# Altium schematic sheet 08-MagnetSensor.SchDoc: Magnet Sensor
size A2; DocumentNumber: 8; SheetNumber: 8; SheetTotal: 15
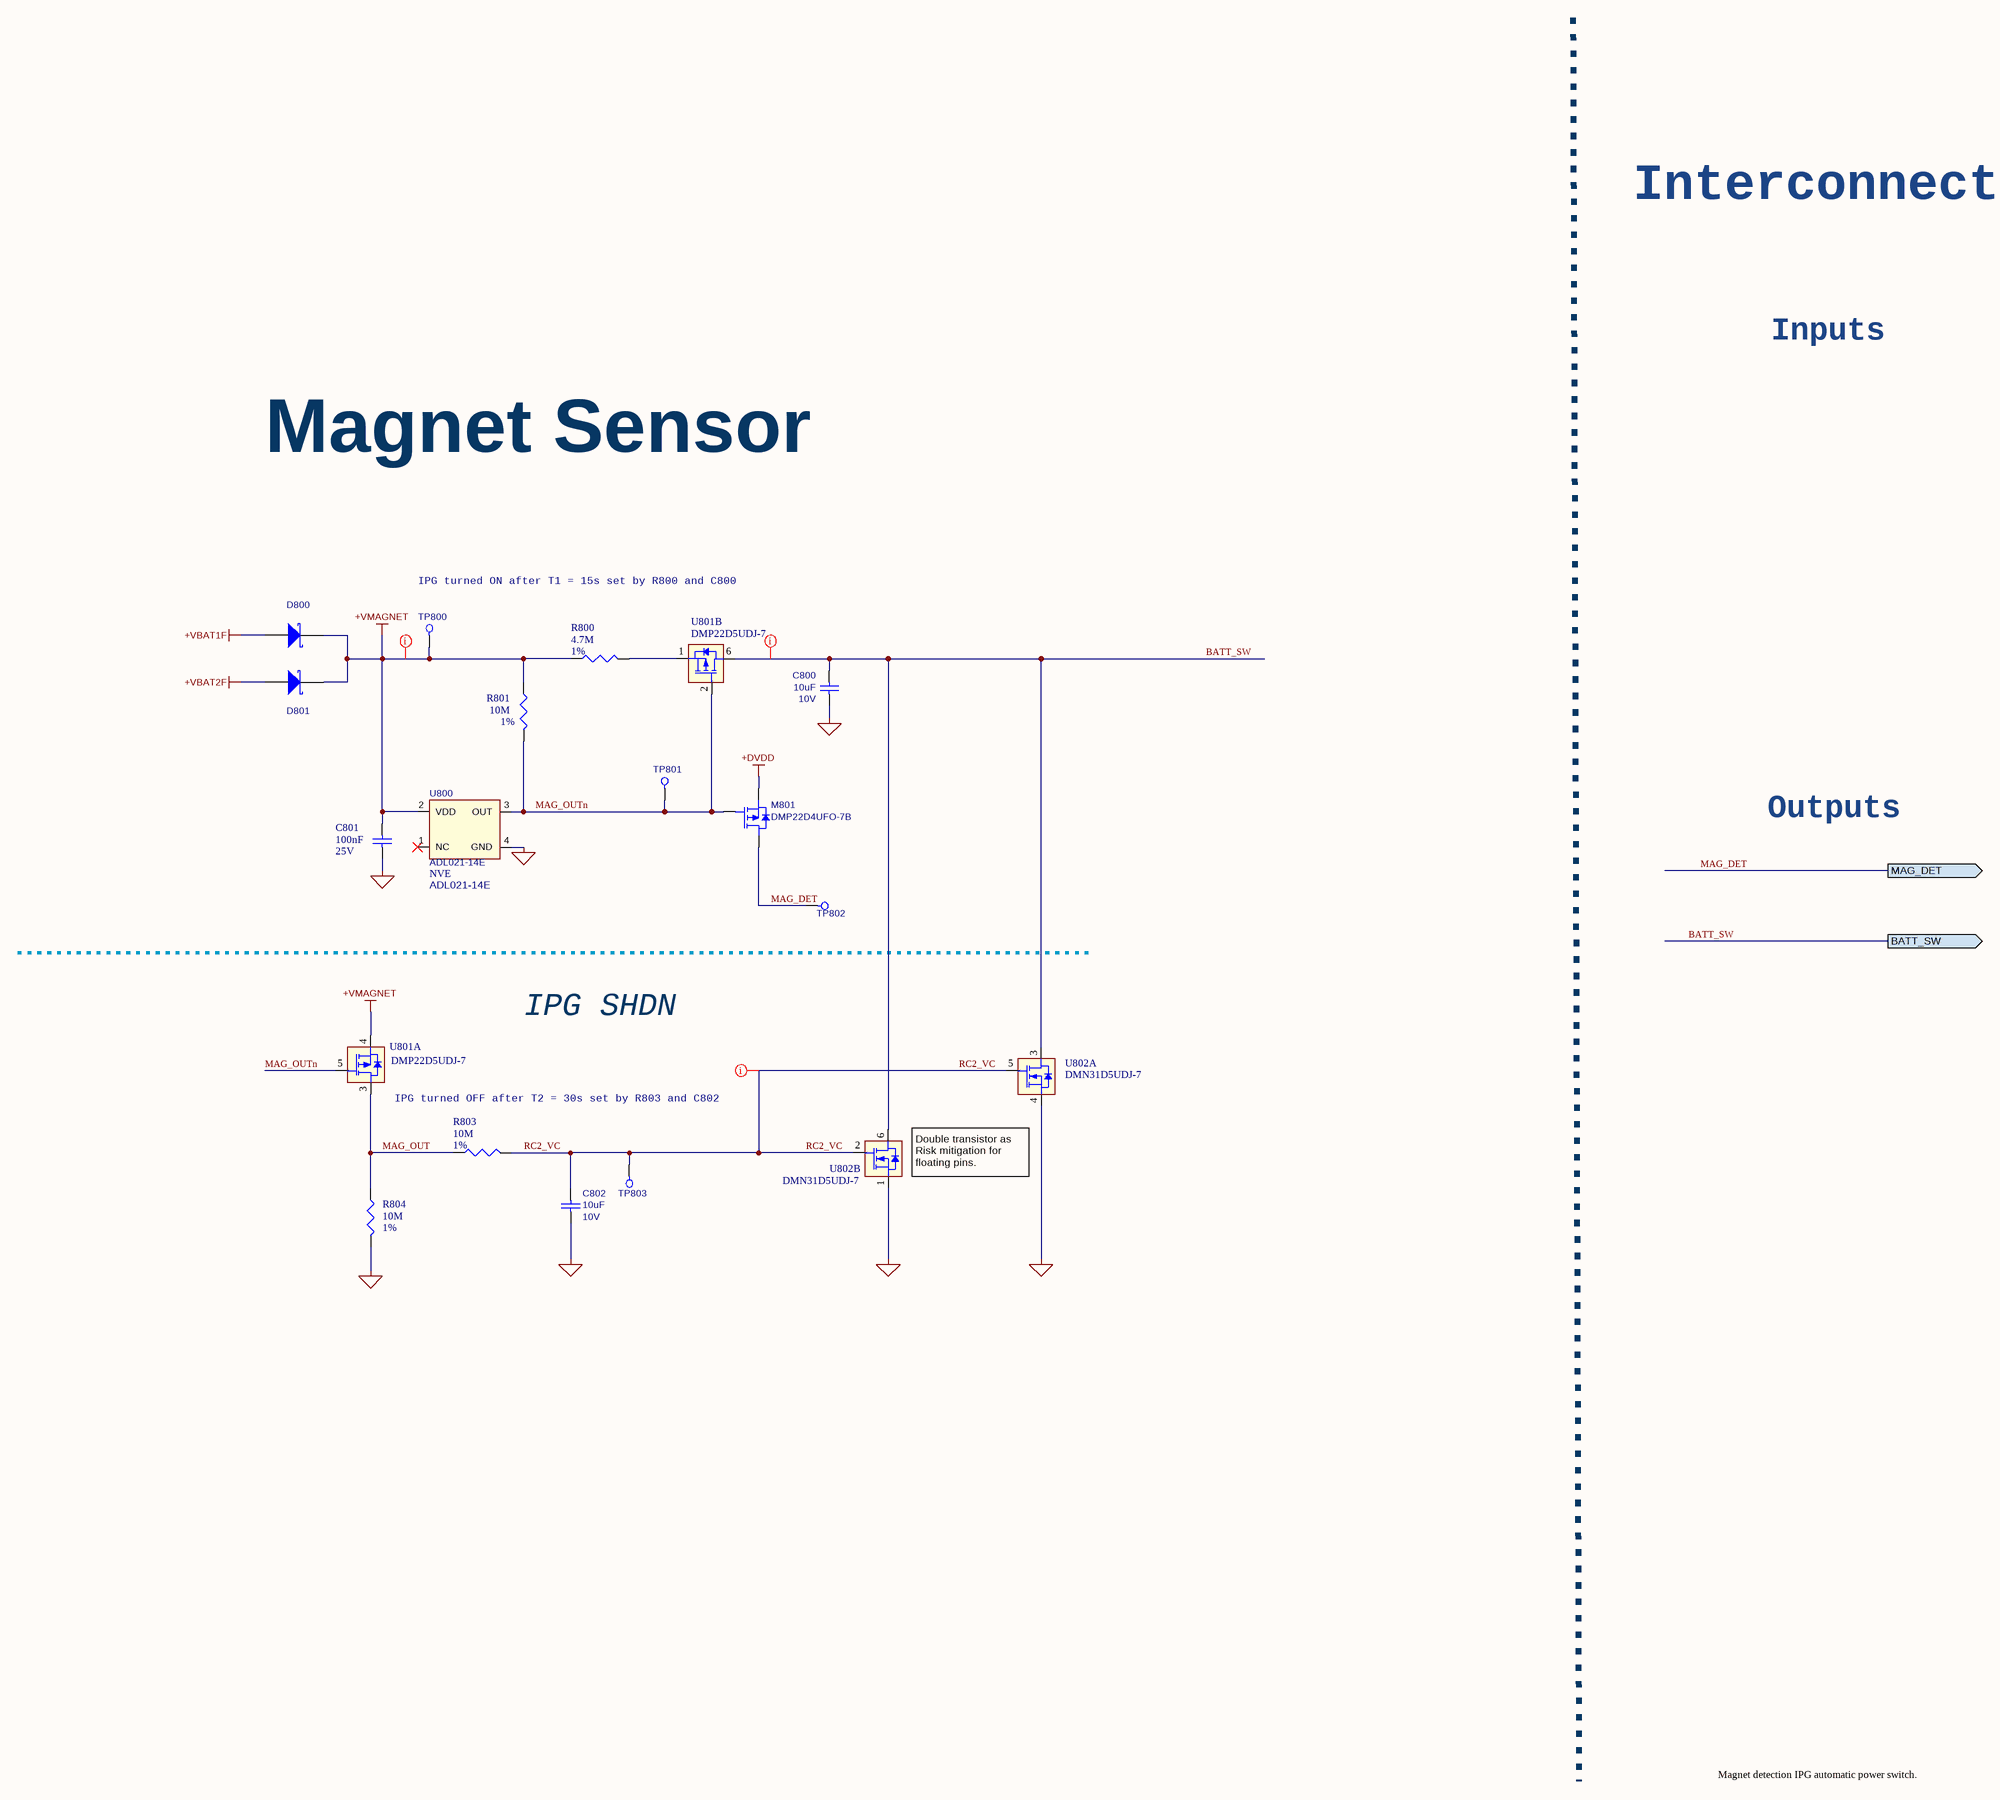
[diagram p0: 08-MagnetSensor.SchDoc]

## Parts
C800  value 10uF  Rating: 10V  [CAP0402_REDUCED]  (hidden comment: ZRB15XR61A106ME01D)
C801  value 100nF  Rated DC Voltage (URdc): 25V  [C0201_C]  (hidden comment: GRM033R61E104KE14J)
C802  value 10uF  Rating: 10V  [CAP0402_REDUCED]  (hidden comment: ZRB15XR61A106ME01D)
D800  NSR0130P2T5G  [ONSC_SOD-923_CASE514AB]  (value not drawn)
D801  NSR0130P2T5G  [ONSC_SOD-923_CASE514AB]  (value not drawn)
M801  DMP22D4UFO-7B  [DIODESINC_X2-DFN0604-3]
R800  value 4.7M  Tolerance: 1%  [R0201_C]  (hidden comment: CRCW02014M70FNED)
R801  value 10M  Tolerance: 1%  [R0201_C]  (hidden comment: CRCW020110M0FNED)
R803  value 10M  Tolerance: 1%  [R0201_C]  (hidden comment: CRCW020110M0FNED)
R804  value 10M  Tolerance: 1%  [R0201_C]  (hidden comment: CRCW020110M0FNED)
TP800  Test Point  [testpad_0.9mm]  (value not drawn)  (no BOM)
TP801  Test Point  [testpad_0.9mm]  (value not drawn)  (no BOM)
TP802  Test Point  [testpad_0.9mm]  (value not drawn)  (no BOM)
TP803  Test Point  [testpad_0.9mm]  (value not drawn)  (no BOM)
U800  ADL021-14E  Manufacturer: NVE  [NVE_ULLGA4]
U801  DMP22D5UDJ-7  [DIODESINC_SOT-963-6]  (parts A,B of 2)
U802  DMN31D5UDJ-7  [DIODESINC_SOT-963-6]  (parts A,B of 2)

## Ports
BATT_SW (out), MAG_DET (out)

## Nets
+DVDD: M801.2(S)
+VBAT1F: D800.2(A)
+VBAT2F: D801.2(A)
+VMAGNET: C801.2 D800.1(K) D801.1(K) R800.1 R801.1 TP800.1 U800.2(VDD) U801.4
GND: C800.2 C801.1 C802.1 R804.2 U800.4(GND) U802.1 U802.4
BATT_SW: C800.1 U801.6 U802.3 U802.6 ; port BATT_SW
MAG_DET: M801.3(D) TP802.1 ; port MAG_DET
MAG_OUT: R803.1 R804.1 U801.3
MAG_OUTn: M801.1(G) R801.2 TP801.1 U800.3(OUT) U801.2 U801.5
RC2_VC: C802.2 R803.2 TP803.1 U802.2 U802.5
NetR800_2: R800.2 U801.1

Not connected (* = marked no-connect by the designer): U800 1(NC)*

## Layout directives
net class ANALOG: BATT_SW, RC2_VC
Voltage: 2.8-4.2V; net class POWER: +VMAGNET

## Notes on the sheet
- Interconnect
- Inputs
- Magnet Sensor
- IPG turned ON after T1 = 15s set by R800 and C800
- Outputs
- IPG SHDN
- (near U801) IPG turned OFF after T2 = 30s set by R803 and C802
- (near U802) Double transistor as Risk mitigation for floating pins.
- Magnet detection IPG automatic power switch.
- Project:
- Schematic:
- Design by:
- Date:
- Ver:
- .
- Comments:
- Reviewed by:

## Library data of the parts
C800 C802 = ZRB15XR61A106ME01D: Capacitor, 10uf, X5R, 10V, 20%, 0402, Implant-grade; Manufacturer: Murata; Medical Grade MFR: TBD; Length (mm): 1.00 ±0.22; Medical Grade MFR PN: TBD; PCB Footprint: cap0402_reduced; Thickness (mm): 0.65 ±0.2; Width (mm): 0.50 ±0.2; Category: Capacitor; Package Description: 0402; Check: *; Status: *; Review: *; Manufacturer Part Number: ZRB15XR61A106ME01D
  C800: Supplier 1: Future Electronics; Supplier Part Number 1: 2114729
  C802: Supplier 1: Arrow Electronics; Supplier Part Number 1: ZRB15XR61A106ME01D
C801 = GRM033R61E104KE14J: Ceramic Capacitor, Multilayer, Ceramic, 25V, 10% +Tol, 10% -Tol, X5R, 15% TC, 0.1uF, Surface Mount, 0201; Manufacturer: Murata; Multilayer: Yes; Category: Ceramic Capacitors; Supplier: Digikey; Supplier Part Number: 490-14571-1-ND; Manufacturer Part Number: GRM033R61E104KE14J; RoHS: Yes; Stock: 1540851; Pricing: 1=0,1, 10=0,033, 50=0,0192, 100=0,0148, 500=0,01118, 1000=0,00878, 2500=0,00798, 5000=0,00734 (USD); Mounting Technology: Surface Mount; Pins: 2; Dielectric Material: Ceramic; Package Shape: Rectangular; Case/Package: 0201; Terminal Finish: Nickel; Min Operating Temperature: -55°C; Max Operating Temperature: 85°C; JESD-609 Code: e3; Capacitor Type: Ceramic; Tolerance  (fill in as +-): 10%; Package Style: SMTMeter; Packaging: Tape and Reel; Tolerance (fill in as +-): 10%; Temperature Characteristics Code: X5R; Termination: Wraparound; Length: 0.6mm; Width: 0.3mm; Height: 0.3mm; Reach SVHC Compliant: Yes; RoHS Compliant: Yes; ComponentLink1URL: https://psearch.en.murata.com:443/capacitor/product/GRM033R61E104KE14%23.pdf?src-supplier=IHS+Markit; ComponentLink1Description: https://psearch.en.murata.com:443/capacitor/product/GRM033R61E104KE14%23.pdf?src-supplier=IHS+Markit; ComponentLink2URL: http://www.mouser.com/ds/2/281/c02e-2905.pdf?src-supplier=Mouser; ComponentLink2Description: http://www.mouser.com/ds/2/281/c02e-2905.pdf?src-supplier=Mouser; ComponentLink3URL: http://search.murata.co.jp/Ceramy/image/img/A01X/G101/ENG/GRM033R61E104KE14-01.pdf?src-supplier=Digikey; ComponentLink3Description: http://search.murata.co.jp/Ceramy/image/img/A01X/G101/ENG/GRM033R61E104KE14-01.pdf?src-supplier=Digikey; ComponentLink4URL: https://search.murata.co.jp/Ceramy/image/img/A01X/G101/ENG/GRM033R61E104KE14-01.pdf?src-supplier=Digikey; ComponentLink4Description: https://search.murata.co.jp/Ceramy/image/img/A01X/G101/ENG/GRM033R61E104KE14-01.pdf?src-supplier=Digikey; Supplier 1: Arrow Electronics; Supplier Part Number 1: GRM033R61E104KE14J
D800 D801 = NSR0130P2T5G: Schottky, 30V, 100mA, 385mV, 200mW, SOD-923; Manufacturer: ON Semiconductor; Medical Grade MFR: TBD; Review: 020823; Length (mm): 1.00 ±0.05; Medical Grade MFR PN: TBD; PCB Footprint: TBD; Rating: 30V; Thickness (mm): 0.40 ±0.03; Value: NSR0130P2T5G; Width (mm): 0.60 ±0.05; Category: Diode; Supplier 1: Future Electronics; Supplier Part Number 1: 7098145; Status: Approved; Manufacturer Part Number: NSR0130P2T5G
M801 = DMP22D4UFO-7B: MOSFET, P-chan, -20V, -383mA, DFN0604; Manufacturer: Diodes Inc; Medical Grade MFR: TBD; Review: 020823; Category: Transistor; Length (mm): 0.60 ±0.05; Medical Grade MFR PN: TBD; Rating: -20V; Thickness (mm): 0.36 ±0.04; Width (mm): 0.40 ±0.05; Value: DMP22D4UFO-7B; PCB Footprint: TBD; Supplier 1: Digi-Key; Supplier Part Number 1: 31-DMP22D4UFO-7BCT-ND; Status: Approved; Manufacturer Part Number: DMP22D4UFO-7B
R800 = CRCW02014M70FNED: Fixed Resistor, Metal Glaze/thick Film, 0.05W, 4700000ohm, 30V, 1% +/-Tol, 200ppm/Cel, Surface Mount, 0201; Manufacturer: Vishay Dale; Medical Grade MFR: TBD; Manufacturer Series: CRCW0201E3; Power: 50mW; Rated Temperature: 70°C; Temperature Coefficient: 200ppm/°C; Category: Chip SMD Resistors; Supplier: Digikey; Supplier Part Number: 541-CRCW02015M10FNEDCT-ND; Manufacturer Part Number: CRCW02014M70FNED; RoHS: Yes; Stock: 56300; Pricing: 1=0,1, 10=0,037, 50=0,0242, 100=0,0204, 500=0,01426, 1000=0,01241, 5000=0,00924 (USD); Mounting Technology: Surface Mount; Pins: 2; Package Shape: Rectangular; Case/Package: 0201; Terminal Finish: Nickel; Min Operating Temperature: -55°C; Max Operating Temperature: 155°C; JESD-609 Code: e3; Resistor Type: FIXED RESISTOR; Packaging: Tape and Reel; Technology: METAL GLAZE/THICK FILM; Termination: Wraparound; Working Voltage: 30V; Reach SVHC Compliant: Yes; RoHS Compliant: Yes; ComponentLink1URL: https://datasheet.ciiva.com:443/pdfs/VipMasterIC/IC/VISH/VISH-S-A0002932828/VISH-S-A0002932828-1.pdf?src-supplier=IHS+Markit; ComponentLink1Description: https://datasheet.ciiva.com:443/pdfs/VipMasterIC/IC/VISH/VISH-S-A0002932828/VISH-S-A0002932828-1.pdf?src-supplier=IHS+Markit; ComponentLink2URL: https://datasheet.ciiva.com/7843/1719906-7843192.pdf?src-supplier=Element14; ComponentLink2Description: https://datasheet.ciiva.com/7843/1719906-7843192.pdf?src-supplier=Element14; ComponentLink3URL: https://datasheet.ciiva.com/7843/1719906-7843193.pdf?src-supplier=Element14; ComponentLink3Description: https://datasheet.ciiva.com/7843/1719906-7843193.pdf?src-supplier=Element14; ComponentLink4URL: https://datasheet.ciiva.com/6073/1719906-6073775.pdf?src-supplier=Farnell; ComponentLink4Description: https://datasheet.ciiva.com/6073/1719906-6073775.pdf?src-supplier=Farnell; Medical Grade MFR PN: TBD; Supplier 1: Digikey; Supplier Part Number 1: 541-CRCW02014M70FNEDCT-ND
R801 R803 R804 = CRCW020110M0FNED: Fixed Resistor, Metal Glaze/thick Film, 0.05W, 10000000ohm, 30V, 1% +/-Tol, 200ppm/Cel, Surface Mount, 0201; Manufacturer: Vishay Draloric; Medical Grade MFR: Mini-Systems; Medical Grade MFR PN: MWA96SM-1005F-NS62TR; Power: 50mW; Rated Temperature: 70°C; Temperature Coefficient: 200ppm/°C; Category: Chip SMD Resistors; Supplier: Mouser; Supplier Part Number: 71-CRCW020110M0FNED; Manufacturer Part Number: CRCW020110M0FNED; RoHS: Yes; Stock: 159754; Pricing: 1=0,1, 10=0,024, 50=0,024, 100=0,014, 1000=0,011, 10000=0,006 (USD); Mounting Technology: Surface Mount; Pins: 2; Package Shape: Rectangular; Case/Package: 0201; Terminal Finish: Nickel; Min Operating Temperature: -55°C; Max Operating Temperature: 155°C; JESD-609 Code: e3; Resistor Type: FIXED RESISTOR; Packaging: Tape and Reel; Technology: METAL GLAZE/THICK FILM; Termination: Wraparound; Working Voltage: 30V; Reach SVHC Compliant: Yes; RoHS Compliant: Yes; ComponentLink1URL: https://datasheet.ciiva.com:443/pdfs/VipMasterIC/IC/VISH/VISH-S-A0002932828/VISH-S-A0002932828-1.pdf?src-supplier=IHS+Markit; ComponentLink1Description: https://datasheet.ciiva.com:443/pdfs/VipMasterIC/IC/VISH/VISH-S-A0002932828/VISH-S-A0002932828-1.pdf?src-supplier=IHS+Markit; ComponentLink2URL: https://datasheet.ciiva.com/7673/1719906-7673177.pdf?src-supplier=Element14; ComponentLink2Description: https://datasheet.ciiva.com/7673/1719906-7673177.pdf?src-supplier=Element14; ComponentLink3URL: https://datasheet.ciiva.com/7673/1719906-7673178.pdf?src-supplier=Element14; ComponentLink3Description: https://datasheet.ciiva.com/7673/1719906-7673178.pdf?src-supplier=Element14; ComponentLink4URL: https://datasheet.ciiva.com/22692/1719906-22692711.pdf?src-supplier=Element14; ComponentLink4Description: https://datasheet.ciiva.com/22692/1719906-22692711.pdf?src-supplier=Element14; ComponentLink5URL: https://datasheet.ciiva.com/22665/1700795-22665701.pdf?src-supplier=Element14; ComponentLink5Description: https://datasheet.ciiva.com/22665/1700795-22665701.pdf?src-supplier=Element14; Supplier 1: Digikey; Supplier Part Number 1: 541-CRCW020110M0FNEDCT-ND
TP800-TP803 = Test Point: Test pad, 0.90mm circular pad; PCB Footprint: testpad_0p90mm; Length (mm): 0.90; Manufacturer: N/A; Manufacturer PN: N/A; Medical Grade MFR: N/A; Medical Grade MFR PN: N/A; Rating: N/A; Thickness (mm): N/A; Value: Test point; Width (mm): 0.90; Category: Test point; Status: *; Review: *
U800 = ADL021-14E: Magnet Sensor, 15 Gauss, ULLGA4, Implant-grade; Medical Grade MFR PN: BD020-14E; PCB Footprint: TBD; Length (mm): 1.10; Medical Grade MFR: NVE; Rating: N/A; Thickness (mm): 0.40; Value: ADL021-14E; Width (mm): 1.10; Category: IC; Package Description: TBD; Supplier 1: Digi-Key; Supplier Part Number 1: 391-ADL021-14ECT-ND; Status: *; Review: *; Manufacturer Part Number: ADL021-14E
U801 = DMP22D5UDJ-7: MOSFET 2P-CH 20V 0.36A SOT963; Manufacturer: Diodes inc.; Number of Channels: 2; Power Dissipation: 380mW; Id(Max): -360mA; Vds(Max): -20V; Vgs(Max): ±8V; Vth(Max): -1.0V; Ron(Max): 5Ohm; Cin: 17pF; Manufacturer Part Number: DMP22D5UDJ-7; Category: Transistors; Type: MOSFET array; RoHs: RoHS 2; Package: SOT-963; Supplier 1: Digikey; Supplier Part Number 1: 31-DMP22D5UDJ-7DKR-ND
U802 = DMN31D5UDJ-7: MOSFET 2N-CH 30V 0.22A SOT963; Manufacturer: Diodes inc.; Number of Channels: 2; Power Dissipation: 350mW; Id(Max): 220mA; Vgs(Max): ±12V; Vth(Max): 1.0V; Ron(Max): 4.5Ohm; Cin: 22.6pF; Manufacturer Part Number: DMN31D5UDJ-7; Category: Transistors; Vds(Max): 30V; Type: MOSFET array; RoHs: RoHS 2; Package: SOT-963; Supplier 1: Digikey; Supplier Part Number 1: 31-DMN31D5UDJ-7CT-ND